# EAGLE design Assignment1-5VAC-DCCRegulator (EAGLE 9.6.2)
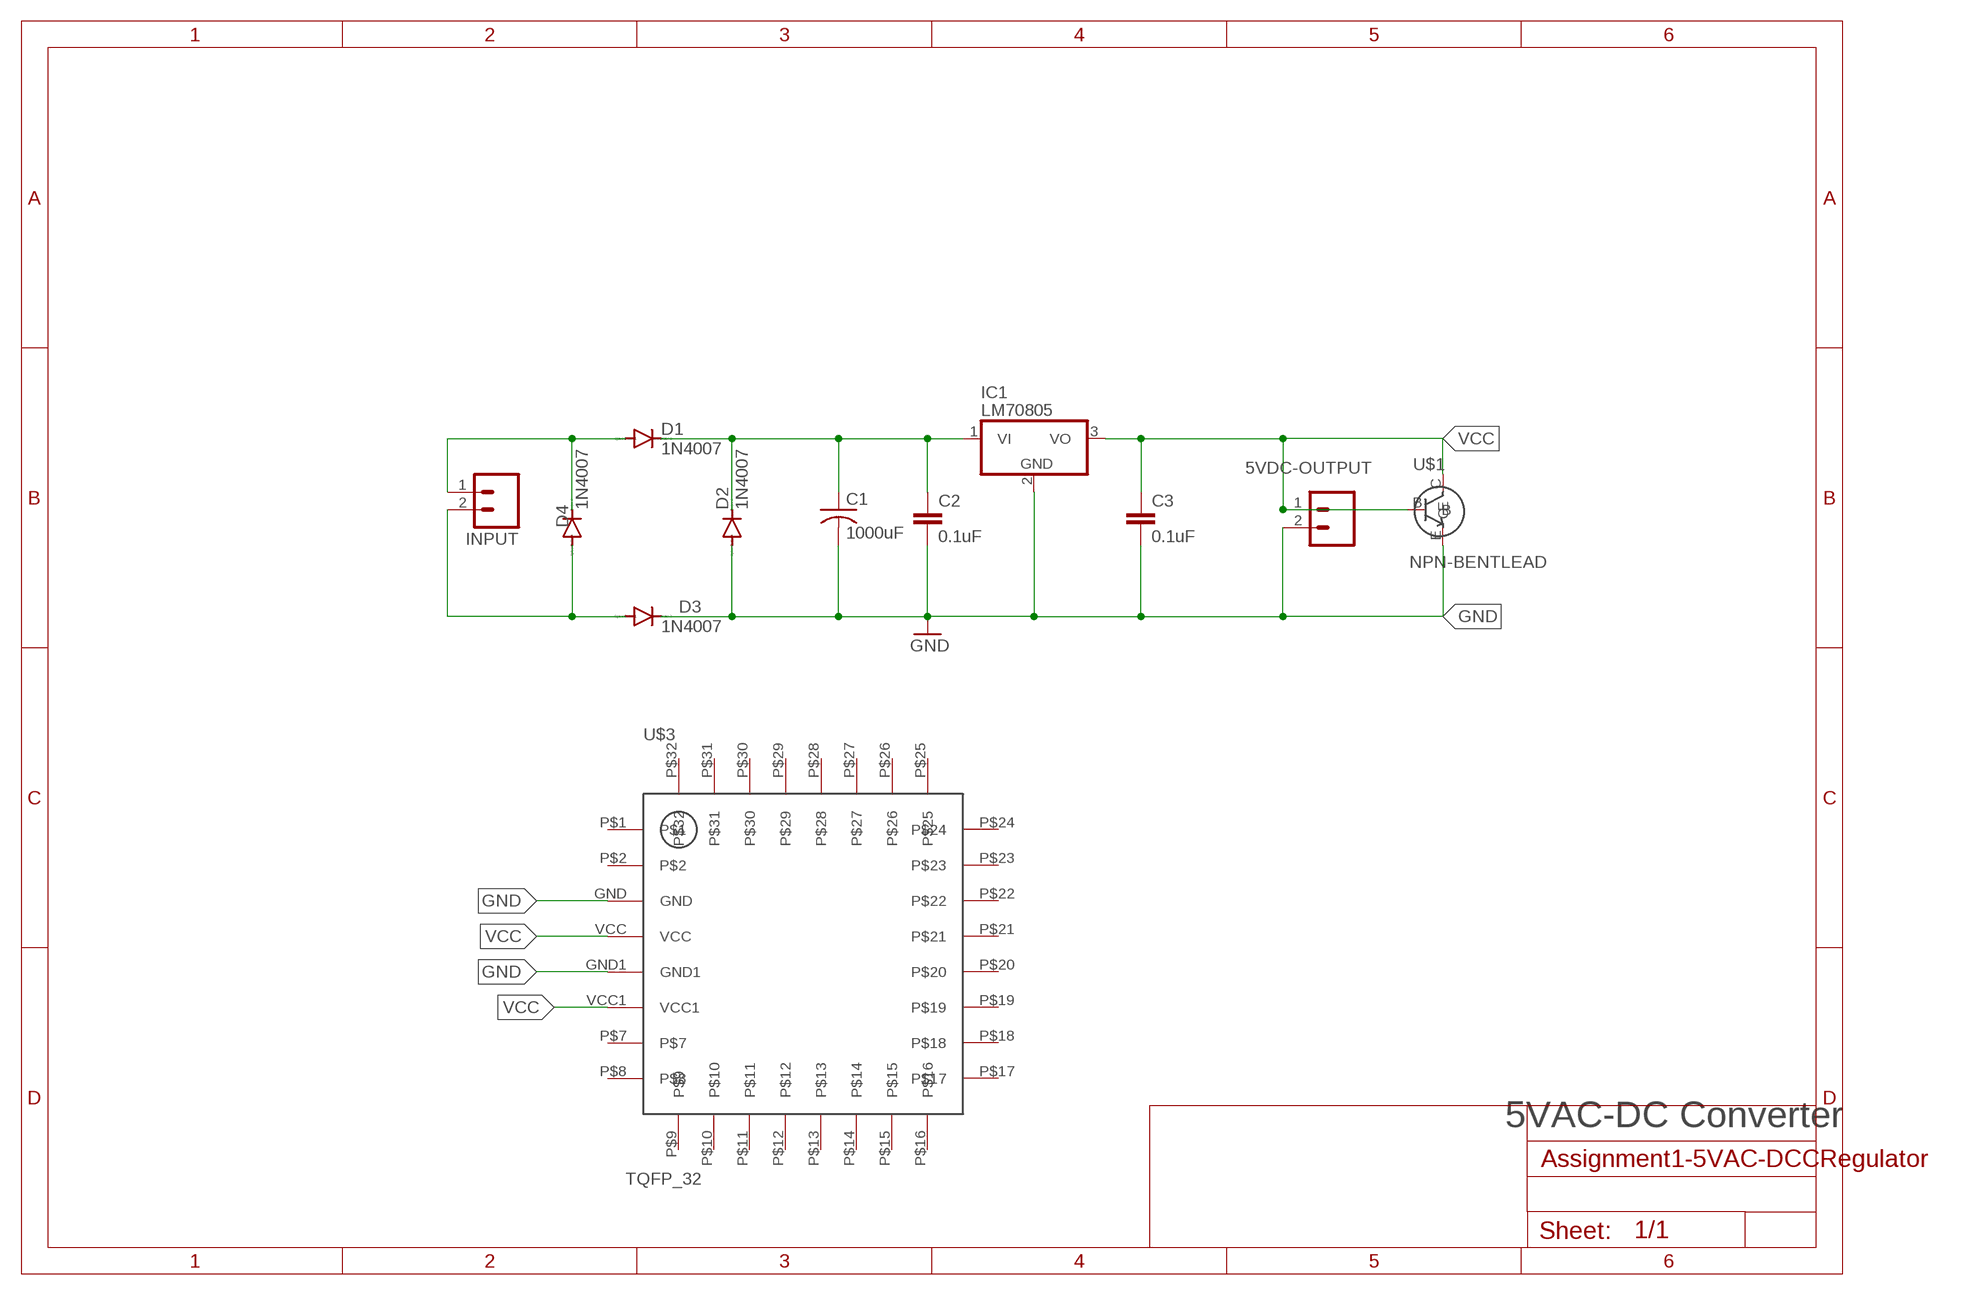
[diagram p0: schematic, sheet 1]

## Parts
5VDC-OUTPUT  M02  [02P]
C1  1000uF  C-US025-024X044  [C025-024X044]
C2  0.1uF  C-EU025-025X050  [C025-025X050]
C3  0.1uF  C-EU025-025X050  [C025-025X050]
D1  1N4007  1N4004  [DO41-10]
D2  1N4007  1N4004  [DO41-10]
D3  1N4007  1N4004  [DO41-10]
D4  1N4007  1N4004  [DO41-10]
IC1  LM70805  786TV  [TO220V]
INPUT  M02  [02P]
U$1  NPN-BENTLEAD  [BENT-LEAD]
U$3  TQFP_32  [TQFP_32]

## Nets
GND: 5VDC-OUTPUT.2 C1.2 C2.2 C3.2 D2.A D3.C IC1.2(GND) U$1.E U$3.GND U$3.GND1
N$1: D1.A D4.C INPUT.1
N$2: D3.A D4.A INPUT.2
N$4: C1.1 C2.1 D1.C D2.C IC1.1(VI)
VCC: 5VDC-OUTPUT.1 C3.1 IC1.3(VO) U$1.B U$1.C U$3.VCC U$3.VCC1
Unconnected: U$3.P$1 U$3.P$2 U$3.P$7 U$3.P$8 U$3.P$9 U$3.P$10 U$3.P$11 U$3.P$12 U$3.P$13 U$3.P$14 U$3.P$15 U$3.P$16 U$3.P$17 U$3.P$18 U$3.P$19 U$3.P$20 U$3.P$21 U$3.P$22 U$3.P$23 U$3.P$24 U$3.P$25 U$3.P$26 U$3.P$27 U$3.P$28 U$3.P$29 U$3.P$30 U$3.P$31 U$3.P$32

## Notes on the sheet
- 5VAC-DC Converter

## Library data of the parts
5VDC-OUTPUT INPUT = con-amp-quick:M02: AMP QUICK CONNECTOR; OC_FARNELL: unknown; OC_NEWARK: unknown
C1 = rcl:C-US: CAPACITOR, American symbol; SPICEPREFIX: C
C2 C3 = rcl:C-EU: CAPACITOR, European symbol; SPICEPREFIX: C
D1-D4 = diode:1N4004: DIODE general purpose rectifier, 1 A
IC1 = linear:78*: Positive VOLTAGE REGULATOR Source: http://cache.national.com/ds/LM/LM78L05.pdf http://www.fairchildsemi.com/ds/LM/LM7805.pdf
U$1 = BC368:NPN-BENTLEAD
U$3 = SAM-MEGA8:TQFP_32

## Board
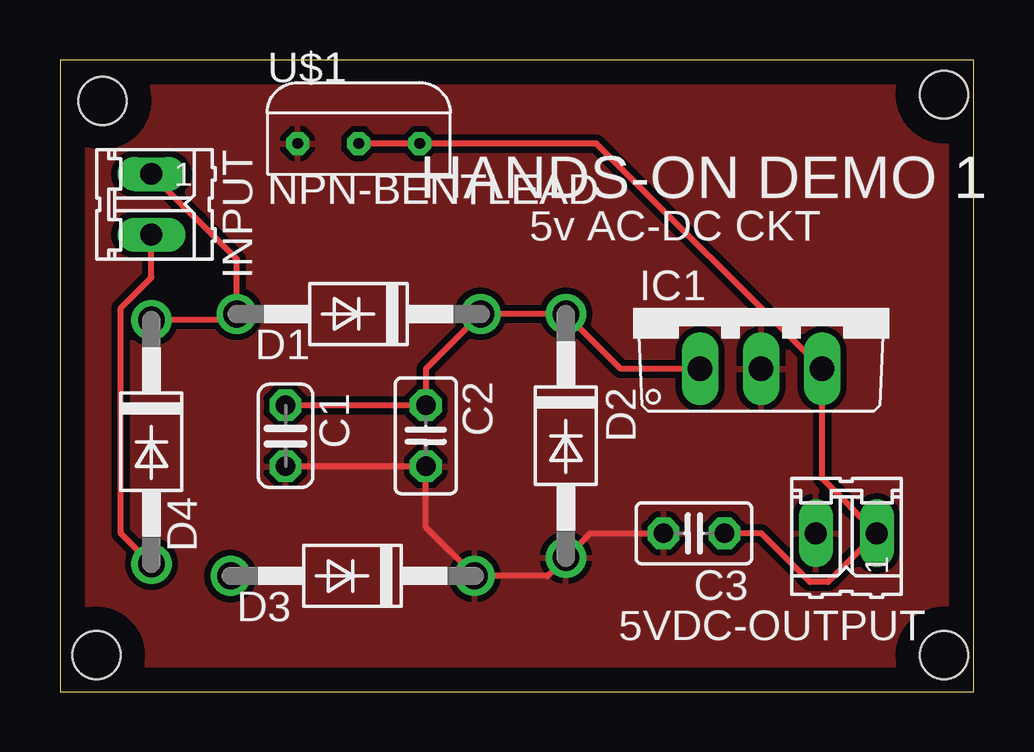
[diagram p1: board, top side]
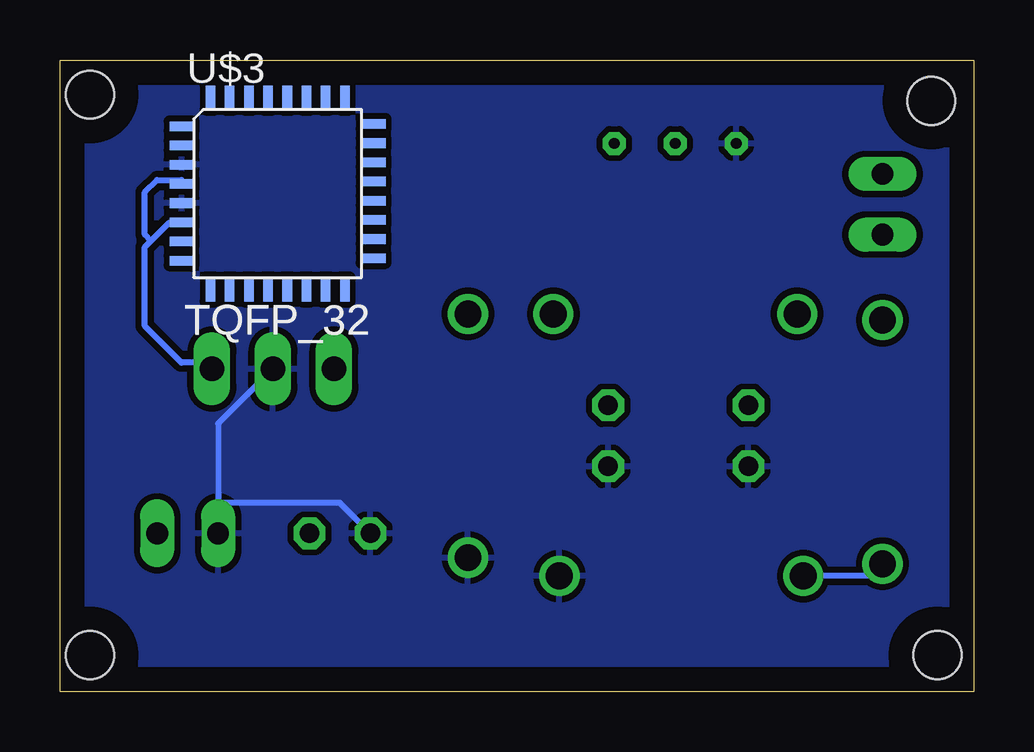
[diagram p2: board, bottom side, seen from below]

Size 38.08 x 26.34 mm. Coordinates in mm from the lower left corner, seen from the top.
Outline: 0,0 38.08,0 38.08,26.34 0,26.34 0,0
Copper layers (1*16): Top 0.035mm / dielectric 1.5mm / Bottom 0.035mm
Design rules "default *": minimum track width 10mil, minimum drill 0.35mm, track to track 10mil, track to pad 10mil, pad to pad 10mil, via to via 10mil, smd to smd 10mil, copper to edge 40mil, drill to drill 10mil, minimum pad ring 10mil, minimum via ring 8mil, stop-mask expansion 4mil, vias tented up to drill 0mil, thermal gap 10mil
Holes 2 mm at 1.78,24.64 36.83,24.89 1.52,1.52 36.83,1.52

### Footprints (pad centres in the part's own frame; a part is rotated, then mirrored left to right if it is on the bottom)
02P = drill 0.914 long: 1 -1.27,0; 2 1.27,0
C025-024X044 = drill 0.813 octagon: 1 -1.27,0; 2 1.27,0
C025-025X050 = drill 0.813 octagon: 1 -1.27,0; 2 1.27,0
DO41-10 = drill 1.118: A 5.08,0; C -5.08,0
TO220V = drill 1.016 long: 1 -2.54,-2.54; 2 0,-2.54; 3 2.54,-2.54
BENT-LEAD = drill 0.45 octagon: B 2.54,0; C 0,0; E -2.54,0
TQFP_32 = smd 1 x 0.4: GND -0.5,4.7; GND1 -0.5,3.1; P$1 -0.5,6.3; P$2 -0.5,5.5; P$7 -0.5,1.5; P$8 -0.5,0.7; P$17 7.5,0.8; P$18 7.5,1.6; P$19 7.5,2.4; P$20 7.5,3.2; P$21 7.5,4; P$22 7.5,4.8; P$23 7.5,5.6; P$24 7.5,6.4; VCC -0.5,3.9; VCC1 -0.5,2.3 | smd 0.4 x 1: P$9 0.7,-0.5; P$10 1.5,-0.5; P$11 2.3,-0.5; P$12 3.1,-0.5; P$13 3.9,-0.5; P$14 4.7,-0.5; P$15 5.5,-0.5; P$16 6.3,-0.5; P$25 6.3,7.5; P$26 5.5,7.5; P$27 4.7,7.5; P$28 3.9,7.5; P$29 3.1,7.5; P$30 2.3,7.5; P$31 1.5,7.5; P$32 0.7,7.5

### Placement (x,y rotation side)
5VDC-OUTPUT  32.77,6.6 180 top
C1  9.4,10.67 270 top
C2  15.24,10.67 270 top
C3  26.42,6.6 180 top
D1  12.45,15.75 180 top
D2  21.08,10.67 270 top
D3  12.19,4.83 180 top
D4  3.81,10.41 270 top
IC1  29.21,16 0 top
INPUT  3.81,20.32 270 top
U$1  12.45,22.86 0 top
U$3  32.51,17.27 0 bottom

### Tracks (layer width: path | path; a pad name or v marks a point on that pad's centre or on a via)
GND
  Top 0.254: C1.2 C2.2 15.24,6.86 D3.C 20.32,4.83 D2.A 22.1,6.6 C3.2
  Bottom 0.254: 31.5,7.87 31.5,11.18 IC1.2 | 31.5,7.87 26.42,7.87 C3.2 | 31.5,7.87 5VDC-OUTPUT.2
  pour Top: -0.48,26.77 38.68,26.77 38.68,-0.81 -1.07,-0.81
  pour Bottom: -0.76,27.43 39.37,27.43 39.37,-1.02 -0.76,-1.02
N$1
  Top 0.254: INPUT.1 7.37,18.03 D1.A 7.11,15.49 D4.C
N$2
  Top 0.254: INPUT.2 3.81,17.27 2.54,16 2.54,6.6 D4.A
  Bottom 0.254: D3.A 4.32,4.83 D4.A
N$4
  Top 0.254: C1.1 C2.1 15.24,13.46 D1.C D2.C 23.37,13.46 IC1.1
VCC
  Top 0.254: C3.1 29.21,6.6 31.24,4.57 32,4.57 5VDC-OUTPUT.1 31.75,8.89 IC1.3 22.35,22.86 U$1.B U$1.C
  Bottom 0.254: 34.29,18.8 34.54,18.54 34.54,15.24 33.02,13.72 32,13.72 IC1.3 | 34.29,18.8 33.53,19.56 33.02,19.56 U$3.VCC1 | 34.29,18.8 34.54,19.05 34.54,20.83 34.04,21.34 33.02,21.34 U$3.VCC

### Text on the board
tPlace: HANDS-ON DEMO 1 | 5v AC-DC CKT